# EAGLE schematic pcb_raspberry_pi (EAGLE 9.6.2)
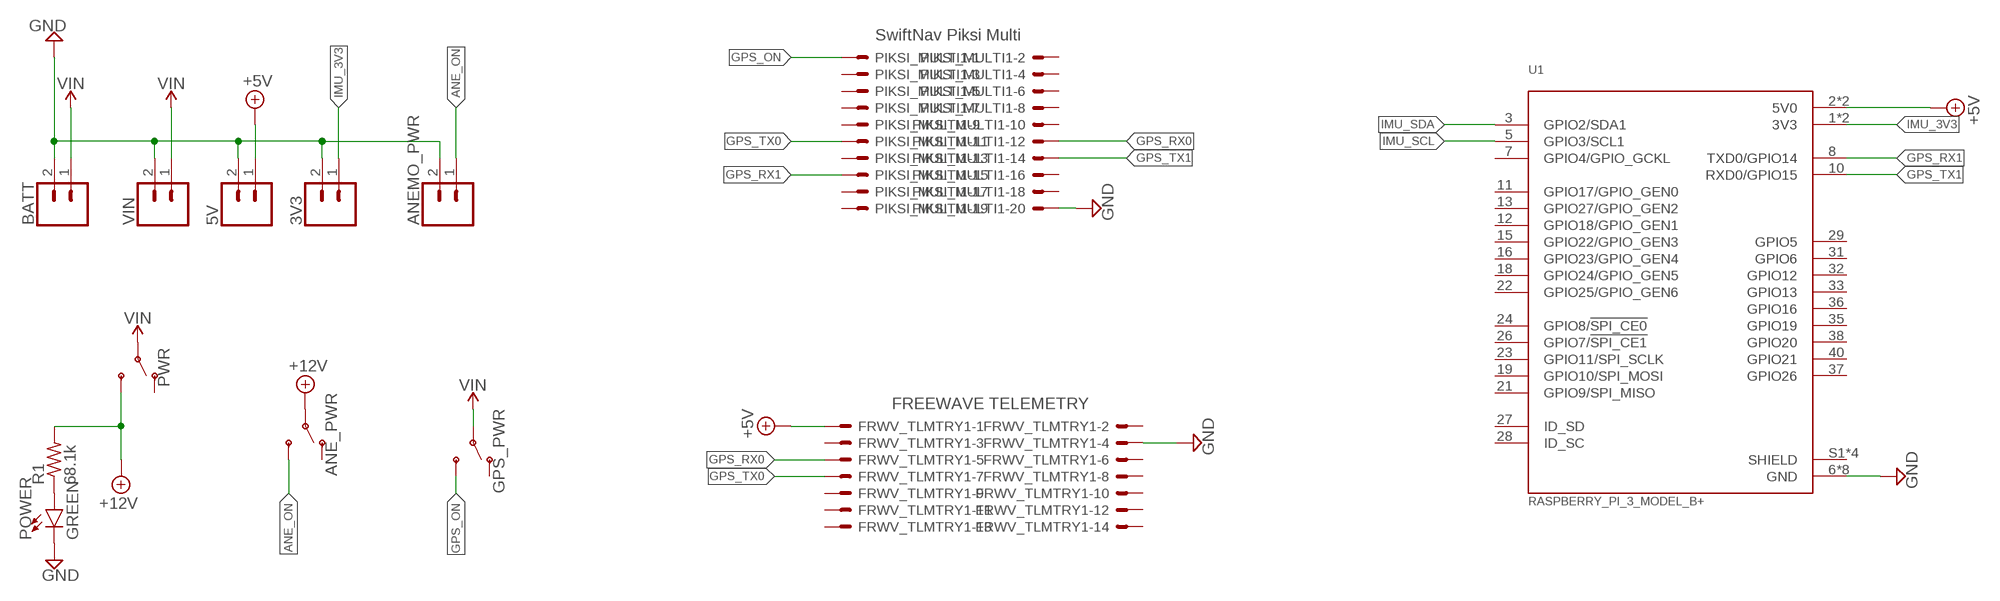
[diagram p0: schematic, sheet 1, part 1 of 2]
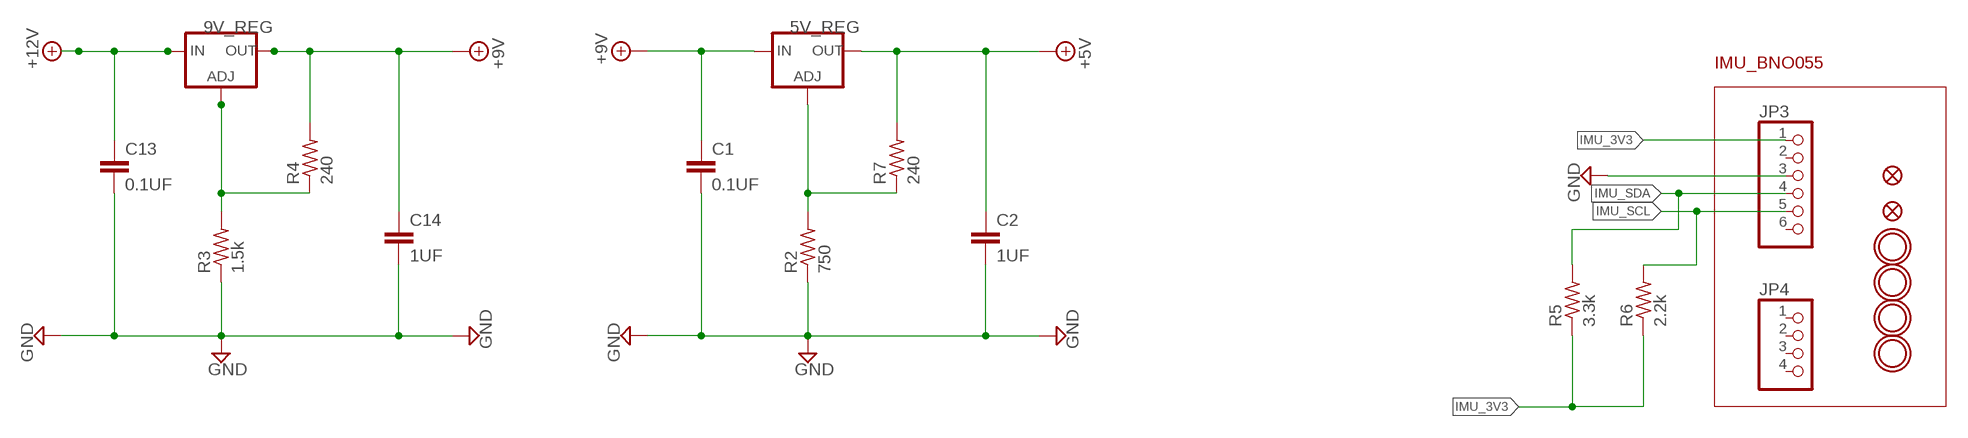
[diagram p1: schematic, sheet 1, part 2 of 2]

## Parts
3V3  CONN_023.5MM  [SCREWTERMINAL-3.5MM-2]
5V  CONN_023.5MM  [SCREWTERMINAL-3.5MM-2]
5V_REG  V_REG_317SMD  [SOT223]
9V_REG  V_REG_317SMD  [SOT223]
ANE_PWR  SWITCH-SPDT-PTH-11.6X4.0MM  [SWITCH_SPDT_PTH_11.6X4.0MM]
ANEMO_PWR  CONN_023.5MM  [SCREWTERMINAL-3.5MM-2]
BATT  CONN_023.5MM  [SCREWTERMINAL-3.5MM-2]
C1  0.1UF  1UF-25V-10%(0805)  [0805]
C2  1UF  1UF-25V-10%(0805)  [0805]
C13  0.1UF  1UF-25V-10%(0805)  [0805]
C14  1UF  1UF-25V-10%(0805)  [0805]
FID3  FIDUCIAL""  [FIDUCIAL_1MM]
FID4  FIDUCIAL""  [FIDUCIAL_1MM]
FRWV_TLMTRY1  87758-1416  [87758-1416]
GPS_PWR  SWITCH-SPDT-PTH-11.6X4.0MM  [SWITCH_SPDT_PTH_11.6X4.0MM]
JP3  HEADER-1X676MIL  [1X06_ROUND_76]
JP4  HEADER-1X476MIL  [1X04_ROUND_76]
PIKSI_MULTI1  332-20  [332-20]
POWER  GREEN  LED-GREEN1206  [LED-1206]
PWR  SWITCH-SPDT-PTH-11.6X4.0MM  [SWITCH_SPDT_PTH_11.6X4.0MM]
R1  68.1k  R-US_M2012  [M2012]
R2  750  R-US_M2012  [M2012]
R3  1.5k  R-US_M2012  [M2012]
R4  240  R-US_M2012  [M2012]
R5  3.3k  R-US_M2012  [M2012]
R6  2.2k  R-US_M2012  [M2012]
R7  240  R-US_M2012  [M2012]
U1  RASPBERRY_PI_3_MODEL_B+  [MODULE_RASPBERRY_PI_3_MODEL_B+]
U$1  MOUNTINGHOLE2.5_THICK  [MOUNTINGHOLE_2.5_PLATED_THICK]
U$2  MOUNTINGHOLE2.5_THICK  [MOUNTINGHOLE_2.5_PLATED_THICK]
U$3  MOUNTINGHOLE2.5_THICK  [MOUNTINGHOLE_2.5_PLATED_THICK]
U$4  MOUNTINGHOLE2.5_THICK  [MOUNTINGHOLE_2.5_PLATED_THICK]
VIN  CONN_023.5MM  [SCREWTERMINAL-3.5MM-2]

## Nets
+5V: 5V.1 5V_REG.2(OUT) C2.1 FRWV_TLMTRY1.1 R7.2 U1.2(5V0) U1.4(5V0)
+9V: 5V_REG.3(IN) 9V_REG.2(OUT) C1.1 C14.1 R4.2
+12V [V_IN]: 9V_REG.3(IN) ANE_PWR.2(P) C13.1 PWR.3(S) R1.2
ANE_ON: ANE_PWR.3(S) ANEMO_PWR.1
GND: 3V3.2 5V.2 ANEMO_PWR.2 BATT.2 C1.2 C2.2 C13.2 C14.2 FRWV_TLMTRY1.4 JP3.3 PIKSI_MULTI1.20 POWER.C R2.1 R3.1 U1.6(GND) U1.9(GND) U1.14(GND) U1.20(GND) U1.25(GND) U1.30(GND) U1.34(GND) U1.39(GND) VIN.2
GPS_ON: GPS_PWR.3(S) PIKSI_MULTI1.1
GPS_RX0: FRWV_TLMTRY1.5 PIKSI_MULTI1.12
GPS_RX1: PIKSI_MULTI1.15 U1.8(TXD0/GPIO14)
GPS_TX0: FRWV_TLMTRY1.7 PIKSI_MULTI1.11
GPS_TX1: PIKSI_MULTI1.14 U1.10(RXD0/GPIO15)
IMU_3V3: 3V3.1 JP3.1 R5.1 R6.1 U1.1(3V3) U1.17(3V3)
IMU_SCL: JP3.5 R6.2 U1.5(GPIO3/SCL1)
IMU_SDA: JP3.4 R5.2 U1.3(GPIO2/SDA1)
N$2: 9V_REG.1(ADJ) R3.2 R4.1
N$3: POWER.A R1.1
N$5: 5V_REG.1(ADJ) R2.2 R7.1
VIN [V_IN]: BATT.1 GPS_PWR.2(P) PWR.2(P) VIN.1
Unconnected: ANE_PWR.1(O) FRWV_TLMTRY1.2 FRWV_TLMTRY1.3 FRWV_TLMTRY1.6 FRWV_TLMTRY1.8 FRWV_TLMTRY1.9 FRWV_TLMTRY1.10 FRWV_TLMTRY1.11 FRWV_TLMTRY1.12 FRWV_TLMTRY1.13 FRWV_TLMTRY1.14 GPS_PWR.1(O) JP3.2 JP3.6 JP4.1 JP4.2 JP4.3 JP4.4 PIKSI_MULTI1.2 PIKSI_MULTI1.3 PIKSI_MULTI1.4 PIKSI_MULTI1.5 PIKSI_MULTI1.6 PIKSI_MULTI1.7 PIKSI_MULTI1.8 PIKSI_MULTI1.9 PIKSI_MULTI1.10 PIKSI_MULTI1.13 PIKSI_MULTI1.16 PIKSI_MULTI1.17 PIKSI_MULTI1.18 PIKSI_MULTI1.19 PWR.1(O) U1.7(GPIO4/GPIO_GCKL) U1.11(GPIO17/GPIO_GEN0) U1.12(GPIO18/GPIO_GEN1) U1.13(GPIO27/GPIO_GEN2) U1.15(GPIO22/GPIO_GEN3) U1.16(GPIO23/GPIO_GEN4) U1.18(GPIO24/GPIO_GEN5) U1.19(GPIO10/SPI_MOSI) U1.21(GPIO9/SPI_MISO) U1.22(GPIO25/GPIO_GEN6) U1.23(GPIO11/SPI_SCLK) U1.24(GPIO8/!SPI_CE0!) U1.26(GPIO7/!SPI_CE1!) U1.27(ID_SD) U1.28(ID_SC) U1.29(GPIO5) U1.31(GPIO6) U1.32(GPIO12) U1.33(GPIO13) U1.35(GPIO19) U1.36(GPIO16) U1.37(GPIO26) U1.38(GPIO20) U1.40(GPIO21)

## Notes on the sheet
- SwiftNav Piksi Multi
- IMU_BNO055
- FREEWAVE TELEMETRY

## Power pins joined to a net without a drawn wire
SHIELD: U1.S1(SHIELD) U1.S2(SHIELD) U1.S3(SHIELD) U1.S4(SHIELD)

## Library data of the parts
3V3 5V ANEMO_PWR VIN = SparkFun-Connectors:CONN_02: Multi connection point. Often used as Generic Header-pin footprint for 0.1 inch spaced/style header connections On any of the 0.1 inch spaced packages, you can populate with these: Break Away Headers - Straight <https://www.sparkfun.com/products/116> (PRT-00116) Break Away Male Headers - Right Angle <https://www.sparkfun.com/products/553> (PRT-00553) Female Headers <https://www.sparkfun.com/products/115> (PRT-00115) Break Away Headers - Machine Pin <https://www.sparkfun.com/products/117> (PRT-00117) Break Away Female Headers - Swiss Machine Pin <https://www.sparkfun.com/products/743> (PRT-00743) For SCREWTERMINALS and SPRING TERMINALS visit here: Screw Terimnals on SparkFun.com <https://www.sparkfun.com/search/results?term=Screw+Terminals> (5mm/3.5mm/2.54mm spacing) This device is also useful as a general connection point to wire up your design to another part of your project. Our various solder wires solder well into these plated through hole pads. Hook-Up Wire - Assortment (Stranded, 22 AWG) <https://www.sparkfun.com/products/11375> (PRT-11375) Hook-Up Wire - Assortment (Solid Core, 22 AWG) <https://www.sparkfun.com/products/11367> (PRT-11367) View the entire wire category on our website here <https://www.sparkfun.com/categories/141> Special notes: Molex polarized connector foot print use with: PRT-08233 with associated crimp pins and housings. 2.54_SCREWTERM for use with PRT-10571. 3.5mm Screw Terminal footprints for PRT-08084 5mm Screw Terminal footprints for use with PRT-08432; PROD_ID: CONN-08399
5V_REG 9V_REG = SparkFun-PowerIC:V_REG_317: Voltage Regulator Standard LM317 adjustable voltage regulator. AOI (Adjust Output Input). Google 'LM317 Calculator' for easy to use app to get the two resistor values needed. 240/720 for 5V output. 240/390 for 3.3V output. Spark Fun Electronics SKU : COM-00527; OC_NEWARK: unknown
ANE_PWR GPS_PWR PWR = SparkFun-Switches:SWITCH-SPDT: Single Pole, Double Throw (SPDT) Switch Single-pole, double-throw (SPDT) switch. Variant Overview SMD-AYZ0202 Surface Mount DPDT Switch <https://www.sparkfun.com/products/597> (COM-00597) Used on e.g. LilyPad Arduino USB - ATmega32U4 Board <https://www.sparkfun.com/products/12049> PTH-11.6X4.0MM SPDT Mini Power Switch <https://www.sparkfun.com/products/102> (COM-00102) Used on e.g. SparkFun Simon Says - Through-Hole Soldering Kit <https://www.sparkfun.com/products/10547> (KIT-10547) PTH-11.6X4.0MM-KIT KIT version of SPDT Mini Power Switch - Simplifies soldering by removing tStop of switch pins - only one side can be soldered. PTH-11.6X4.0MM-LOCK LOCK version of SPDT Mini Power Switch - Offset pins hold switch in place for easier soldering. SMD-RIGHT-ANGLE Surface Mount Right Angle Switch <https://www.sparkfun.com/products/10860> (COM-10860) Used on e.g. SparkFun ESP8266 Thing <https://www.sparkfun.com/products/13231>; PROD_ID: SWCH-08261; SF_SKU: COM-00102
BATT = SparkFun-Connectors:CONN_02: Multi connection point. Often used as Generic Header-pin footprint for 0.1 inch spaced/style header connections On any of the 0.1 inch spaced packages, you can populate with these: Break Away Headers - Straight <https://www.sparkfun.com/products/116> (PRT-00116) Break Away Male Headers - Right Angle <https://www.sparkfun.com/products/553> (PRT-00553) Female Headers <https://www.sparkfun.com/products/115> (PRT-00115) Break Away Headers - Machine Pin <https://www.sparkfun.com/products/117> (PRT-00117) Break Away Female Headers - Swiss Machine Pin <https://www.sparkfun.com/products/743> (PRT-00743) For SCREWTERMINALS and SPRING TERMINALS visit here: Screw Terimnals on SparkFun.com <https://www.sparkfun.com/search/results?term=Screw+Terminals> (5mm/3.5mm/2.54mm spacing) This device is also useful as a general connection point to wire up your design to another part of your project. Our various solder wires solder well into these plated through hole pads. Hook-Up Wire - Assortment (Stranded, 22 AWG) <https://www.sparkfun.com/products/11375> (PRT-11375) Hook-Up Wire - Assortment (Solid Core, 22 AWG) <https://www.sparkfun.com/products/11367> (PRT-11367) View the entire wire category on our website here <https://www.sparkfun.com/categories/141> Special notes: Molex polarized connector foot print use with: PRT-08233 with associated crimp pins and housings. 2.54_SCREWTERM for use with PRT-10571. 3.5mm Screw Terminal footprints for PRT-08084 5mm Screw Terminal footprints for use with PRT-08432; PROD_ID: CONN-08399; SPICEPREFIX: B
C1 C2 C14 = SparkFun-Capacitors:1UF-25V-10%(0805): CAP-08064; OC_NEWARK: unknown; PROD_ID: CAP-08064; VALUE: 1uF
C13 = SparkFun-Capacitors:1UF-25V-10%(0805): CAP-08064; OC_NEWARK: unknown; PROD_ID: CAP-08064; SPICEPREFIX: C; VALUE: 1uF
FID3 FID4 = microbuilder:FIDUCIAL: Fiducial Alignment Points Various fiducial points for machine vision alignment.; BOM: EXCLUDE
FRWV_TLMTRY1 = con-molex:87758-1416: 14 Pin - 2mm Dual Row Single Wafer, Vertical T/H HDR Source: http://www.molex.com/pdm_docs/sd/877580616_sd.pdf; MF: MOLEX; MPN: 87758-1416; OC_FARNELL: 7472358; OC_NEWARK: 59J1562
JP3 = microbuilder:HEADER-1X6: PIN HEADER
JP4 = microbuilder:HEADER-1X4: PIN HEADER
PIKSI_MULTI1 = con-garry:332-20: 20 Pin - 2mm Dual Row Source: www.mpe-connector.de / garry_shortform_2012.pdf
POWER = SparkFun-LED:LED-GREEN: Green SMD LED Used in manufacturing of various products at SparkFun Packages: 0603 - SMD 0603 package [Product Link] <http://www.futureelectronics.com/en/technologies/semiconductors/optoelectronics/leds/Pages/9894312-LTST-C190GKT.aspx?CrossPart=HSMG-C190&IM=0> LilyPad 1206 - SMD1206 LilyPad package [Product Link] <http://www.futureelectronics.com/en/Technologies/Product.aspx?ProductID=IN150NGHARVATEKCORPORATION2049943&IM=0> 1206 - SMD1206 package [Product Link] <http://www.futureelectronics.com/en/technologies/semiconductors/optoelectronics/leds/Pages/8315665-LTST-C150KGKT.aspx?IM=0> 1206 Bottom Mount -SMD 1206 Bottom Mount [Product Link] <http://www.digikey.com/product-detail/en/lite-on-inc/LTST-C230KGKT/160-1456-1-ND/386854> SparkFun Products: Pro Mini 328 -5V <https://www.sparkfun.com/products/821> RedBoard <https://www.sparkfun.com/products/12757> MP3 Trigger <https://www.sparkfun.com/products/13720> Makey Makey <https://www.sparkfun.com/products/11076>; PROD_ID: DIO-00862
R1 = resistor:R-US_: RESISTOR, American symbol; OC_NEWARK: unknown
R2-R4 R7 = adafruit:R-US_: RESISTOR, American symbol; OC_NEWARK: unknown
R5 R6 = resistor:R-US_: RESISTOR, American symbol
U1 = RASPBERRY_PI_3_MODEL_B_:RASPBERRY_PI_3_MODEL_B+: BCM2835 Raspberry Pi Model B+ - ARM11, VideoCore MPU Embedded Evaluation Board; AVAILABILITY: Unavailable; DESCRIPTION: RASPBERRY PI 3 MOD B+ BCM2837B0; MF: Raspberry Pi; MP: RASPBERRY PI 3 MODEL B+; PACKAGE: Raspberry Pi; PRICE: None
U$1-U$4 = microbuilder:MOUNTINGHOLE: Mounting Hole For #2 screws (0.086"/2.18mm width, 0.094"/2.4mm hole) use 2.5mm; BOM: EXCLUDE

## Net classes
0 default: width 0.381 mm, drill 0.381 mm, clearance 0.381 mm
1 V_IN: width 0.508 mm, drill 0.381 mm, clearance 0.381 mm